# Altium project 2018_CARTE_PUISSANCE.PRJPCB
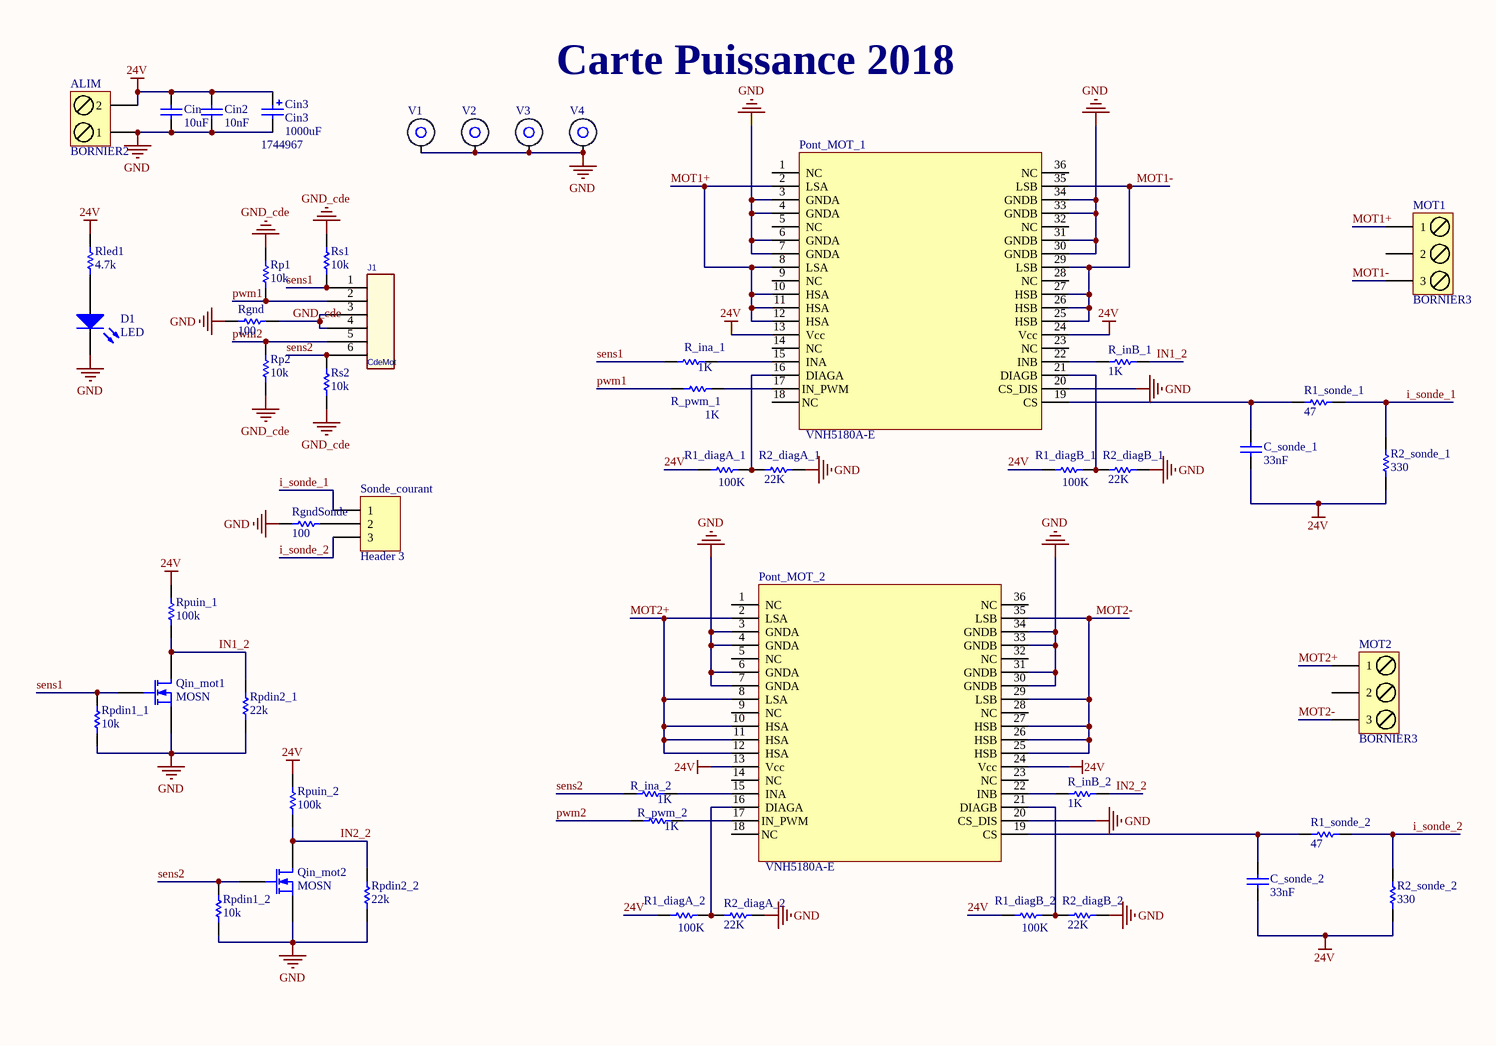
[diagram p0: 2018_CARTE_PUISSANCE.SchDoc, left]
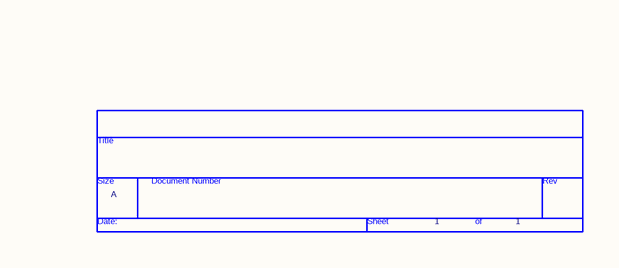
[diagram p1: 2018_CARTE_PUISSANCE.SchDoc, right]
1 sheet, 51 parts. Net scope: global (net labels, ports and power ports of the same name join across sheets).
Board file: 2018_CARTE_PUISSANCE.PCBDOC

## Sheet 2018_CARTE_PUISSANCE.SchDoc
size A4

### Parts
*  Page Count: 1  Page Size: A  (hidden comment: TitleBlock0)  (graphical)
ALIM  BORNIER2  [BORNIER2_MALE_DROIT]
C_sonde_1  33nF  [C0603_N]
C_sonde_2  33nF  [C0603_N]
Cin  10uF  [C1206_N]
Cin2  10nF  [C0805_N]
Cin3  Cin3  value 1000uF  FAR: 1744967  [COND_POL_RAD_5.08B]
D1  LED  [LED_0805]
J1  CdeMot  [RJ11_6/6]
MOT1  BORNIER3  [BORNIER3]
MOT2  BORNIER3  [BORNIER3]
Pont_MOT_1  VNH5180A-E  [PowerSSO-36 TP]
Pont_MOT_2  VNH5180A-E  [PowerSSO-36 TP]
Qin_mot1  MOSN  [SOT23-3N]
Qin_mot2  MOSN  [SOT23-3N]
R1_diagA_1  100K  [R1206_N]
R1_diagA_2  100K  [R1206_N]
R1_diagB_1  100K  [R1206_N]
R1_diagB_2  100K  [R1206_N]
R1_sonde_1  47  [R1206_N]
R1_sonde_2  47  [R1206_N]
R2_diagA_1  22K  [R1206_N]
R2_diagA_2  22K  [R1206_N]
R2_diagB_1  22K  [R1206_N]
R2_diagB_2  22K  [R1206_N]
R2_sonde_1  330  [R1206_N]
R2_sonde_2  330  [R1206_N]
R_ina_1  1K  [R1206_N]
R_ina_2  1K  [R1206_N]
R_inB_1  1K  [R1206_N]
R_inB_2  1K  [R1206_N]
R_pwm_1  1K  [R1206_N]
R_pwm_2  1K  [R1206_N]
Rgnd  100  [R1206_N]
RgndSonde  100  [R1206_N]
Rled1  4.7k  [R1206_N]
Rp1  10k  [R1206_N]
Rp2  10k  [R1206_N]
Rpdin1_1  10k  [R1206_N]
Rpdin1_2  10k  [R1206_N]
Rpdin2_1  22k  [R1206_N]
Rpdin2_2  22k  [R1206_N]
Rpuin_1  100k  [R1206_N]
Rpuin_2  100k  [R1206_N]
Rs1  10k  [R1206_N]
Rs2  10k  [R1206_N]
Sonde_courant  Header 3  [HDR1X3]
V1  Entretoise WURTH CMS  [ENTRETOISE_CMS]  (value not drawn)
V2  Entretoise WURTH CMS  [ENTRETOISE_CMS]  (value not drawn)
V3  Entretoise WURTH CMS  [ENTRETOISE_CMS]  (value not drawn)
V4  Entretoise WURTH CMS  [ENTRETOISE_CMS]  (value not drawn)

### Nets
24V: ALIM.2 C_sonde_1.1 C_sonde_2.1 Cin.2 Cin2.2 Cin3.1 Pont_MOT_1.13(Vcc) Pont_MOT_1.24(Vcc) Pont_MOT_2.13(Vcc) Pont_MOT_2.24(Vcc) R1_diagA_1.1 R1_diagA_2.1 R1_diagB_1.1 R1_diagB_2.1 R2_sonde_1.1 R2_sonde_2.1 Rled1.2 Rpuin_1.2 Rpuin_2.2
GND: ALIM.1 Cin.1 Cin2.1 Cin3.2 D1.2 Pont_MOT_1.3(GNDA) Pont_MOT_1.4(GNDA) Pont_MOT_1.6(GNDA) Pont_MOT_1.7(GNDA) Pont_MOT_1.20(CS_DIS) Pont_MOT_1.30(GNDB) Pont_MOT_1.31(GNDB) Pont_MOT_1.33(GNDB) Pont_MOT_1.34(GNDB) Pont_MOT_2.3(GNDA) Pont_MOT_2.4(GNDA) Pont_MOT_2.6(GNDA) Pont_MOT_2.7(GNDA) Pont_MOT_2.20(CS_DIS) Pont_MOT_2.30(GNDB) Pont_MOT_2.31(GNDB) Pont_MOT_2.33(GNDB) Pont_MOT_2.34(GNDB) Qin_mot1.2(S) Qin_mot2.2(S) R2_diagA_1.2 R2_diagA_2.2 R2_diagB_1.2 R2_diagB_2.2 Rgnd.2 RgndSonde.2 Rpdin1_1.2 Rpdin1_2.2 Rpdin2_1.1 Rpdin2_2.1 V1.1 V2.1 V3.1 V4.1
GND_cde: J1.3 J1.4 Rgnd.1 Rp1.2 Rp2.1 Rs1.2 Rs2.1
i_sonde_1: R1_sonde_1.2 R2_sonde_1.2 Sonde_courant.1
i_sonde_2: R1_sonde_2.2 R2_sonde_2.2 Sonde_courant.3
IN1_2: Qin_mot1.3(D) R_inB_1.2 Rpdin2_1.2 Rpuin_1.1
IN2_2: Qin_mot2.3(D) R_inB_2.2 Rpdin2_2.2 Rpuin_2.1
MOT1+: MOT1.1 Pont_MOT_1.2(LSA) Pont_MOT_1.8(LSA) Pont_MOT_1.10(HSA) Pont_MOT_1.11(HSA) Pont_MOT_1.12(HSA)
MOT1-: MOT1.3 Pont_MOT_1.25(HSB) Pont_MOT_1.26(HSB) Pont_MOT_1.27(HSB) Pont_MOT_1.29(LSB) Pont_MOT_1.35(LSB)
MOT2+: MOT2.1 Pont_MOT_2.2(LSA) Pont_MOT_2.8(LSA) Pont_MOT_2.10(HSA) Pont_MOT_2.11(HSA) Pont_MOT_2.12(HSA)
MOT2-: MOT2.3 Pont_MOT_2.25(HSB) Pont_MOT_2.26(HSB) Pont_MOT_2.27(HSB) Pont_MOT_2.29(LSB) Pont_MOT_2.35(LSB)
pwm1: J1.2 R_pwm_1.1 Rp1.1
pwm2: J1.5 R_pwm_2.1 Rp2.2
sens1: J1.1 Qin_mot1.1(G) R_ina_1.1 Rpdin1_1.1 Rs1.1
sens2: J1.6 Qin_mot2.1(G) R_ina_2.1 Rpdin1_2.1 Rs2.2
NetC_sonde_1_2: C_sonde_1.2 Pont_MOT_1.19(CS) R1_sonde_1.1
NetC_sonde_2_2: C_sonde_2.2 Pont_MOT_2.19(CS) R1_sonde_2.1
NetD1_1: D1.1 Rled1.1
NetPont_MOT_1_15: Pont_MOT_1.15(INA) R_ina_1.2
NetPont_MOT_1_16: Pont_MOT_1.16(DIAGA) R1_diagA_1.2 R2_diagA_1.1
NetPont_MOT_1_17: Pont_MOT_1.17(IN_PWM) R_pwm_1.2
NetPont_MOT_1_21: Pont_MOT_1.21(DIAGB) R1_diagB_1.2 R2_diagB_1.1
NetPont_MOT_1_22: Pont_MOT_1.22(INB) R_inB_1.1
NetPont_MOT_2_15: Pont_MOT_2.15(INA) R_ina_2.2
NetPont_MOT_2_16: Pont_MOT_2.16(DIAGA) R1_diagA_2.2 R2_diagA_2.1
NetPont_MOT_2_17: Pont_MOT_2.17(IN_PWM) R_pwm_2.2
NetPont_MOT_2_21: Pont_MOT_2.21(DIAGB) R1_diagB_2.2 R2_diagB_2.1
NetPont_MOT_2_22: Pont_MOT_2.22(INB) R_inB_2.1
NetRgndSonde_1: RgndSonde.1 Sonde_courant.2

Not connected (* = marked no-connect by the designer): MOT1 2; MOT2 2; Pont_MOT_1 1(NC) 5(NC) 9(NC) 14(NC) 18(NC) 23(NC) 28(NC) 32(NC) 36(NC); Pont_MOT_2 1(NC) 5(NC) 9(NC) 14(NC) 18(NC) 23(NC) 28(NC) 32(NC) 36(NC)

### Notes on the sheet
- Carte Puissance 2018
- (in symbol TitleBlock0) Title; Size; Document Number; Rev; Date:; Sheet; of

### Library data of the parts
ALIM = BORNIER2: Terminal blocks, 2 pins, pitch=5mm
C_sonde_1 C_sonde_2 = Condensateur: Capacitor; Published: 8-Jun-2000; LatestRevisionDate: 17-Jul-2002; LatestRevisionNote: Re-released for DXP Platform.; PackageReference: RAD-0.3; Publisher: Altium Limited
Cin Cin2 = Capacitor: Published: 8-Jun-2000; LatestRevisionDate: 17-Jul-2002; LatestRevisionNote: Re-released for DXP Platform.; PackageReference: RAD-0.3; Publisher: Altium Limited
Cin3 = CONDENSATEUR_POLARISE: Polarized Capacitor; Published: 8-Jun-2000; LatestRevisionDate: 17-Jul-2002; LatestRevisionNote: Re-released for DXP Platform.; PackageReference: RB7.6-15; Publisher: Altium Limited
D1 = LED: Typical LED; Published: 8-Jun-2000; LatestRevisionDate: 08-Jul-2005; LatestRevisionNote: Mech Layer 1 removed.; PackageReference: LED-1; Publisher: Altium Limited
J1 = CONNECTEUR_RJ12
MOT1 MOT2 = BORNIER3: Terminal blocks, 2 pins, pitch=5mm
Qin_mot1 Qin_mot2 = Transistor MOSFET-N: N-Channel MOSFET; PackageDocument: 1995/1996; Published: 8-Jun-2000; LatestRevisionDate: 17-Jul-2002; LatestRevisionNote: Re-released for DXP Platform.; PackageReference: E3; Publisher: Altium Limited
R1_diagA_1 R1_diagA_2 R1_diagB_1 R1_diagB_2 R1_sonde_1 R1_sonde_2 R2_diagA_1 R2_diagA_2 R2_diagB_1 R2_diagB_2 R2_sonde_1 R2_sonde_2 R_ina_1 R_ina_2 R_inB_1 R_inB_2 R_pwm_1 R_pwm_2 Rgnd RgndSonde Rled1 Rp1 Rp2 Rpdin1_1 Rpdin1_2 Rpdin2_1 Rpdin2_2 Rpuin_1 Rpuin_2 Rs1 Rs2 = Resistor: Published: 8-Jun-2000; LatestRevisionDate: 17-Jul-2002; LatestRevisionNote: Re-released for DXP Platform.; PackageReference: AXIAL-0.5; Publisher: Altium Limited
Sonde_courant = Header 3: Header, 3-Pin; LatestRevisionDate: 17-Jul-2002; LatestRevisionNote: Re-released for DXP Platform.; Publisher: Altium Limited
V1-V4 = Entretoise WURTH CMS: Entretoise Wurth; Publisher: Damien Guitton
* = TitleBlock0: Page Number: 1; Page Create Date: March  8, 1995
Pont_MOT_1 Pont_MOT_2 = VNH5180A-E: Type: VNH5180A-E